# Altium schematic sheet Alimentacion y perifericos.SchDoc
size A4; SheetNumber: 3; SheetTotal: 5
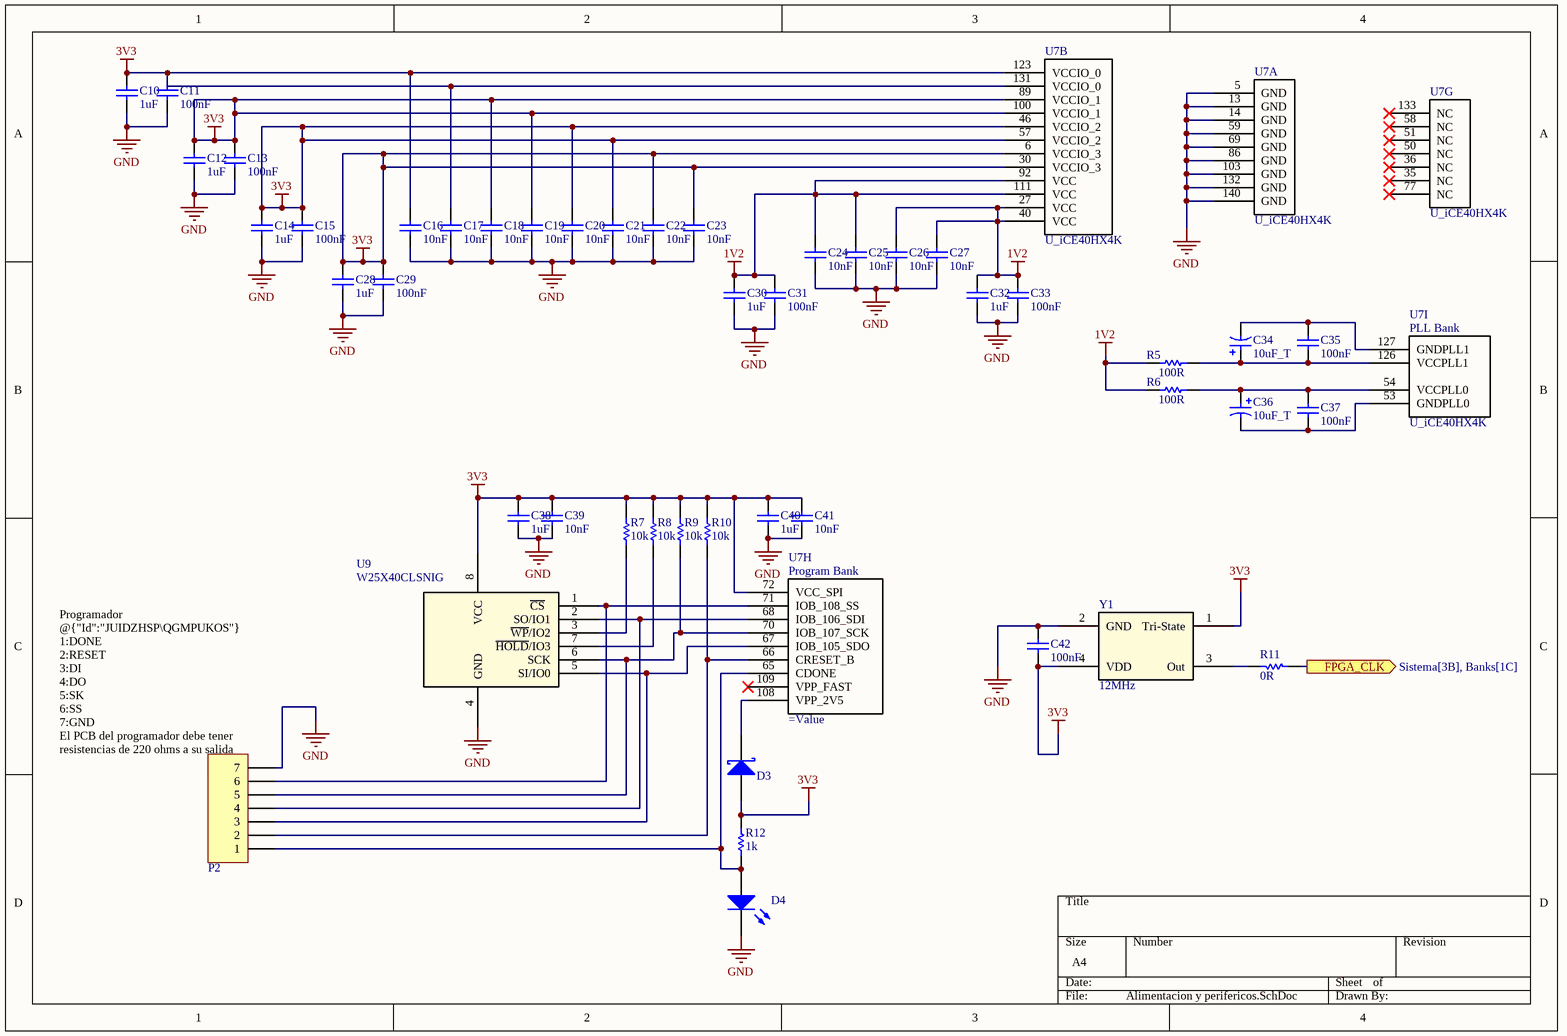
[diagram p0: Alimentacion y perifericos.SchDoc]

## Parts
C10  1uF  [C_0805_2013_b]
C11  100nF  [C_0805_2013_b]
C12  1uF  [C_0805_2013_b]
C13  100nF  [C_0805_2013_b]
C14  1uF  [C_0805_2013_b]
C15  100nF  [C_0805_2013_b]
C16  10nF  [C_0805_2013_b]
C17  10nF  [C_0805_2013_b]
C18  10nF  [C_0805_2013_b]
C19  10nF  [C_0805_2013_b]
C20  10nF  [C_0805_2013_b]
C21  10nF  [C_0805_2013_b]
C22  10nF  [C_0805_2013_b]
C23  10nF  [C_0805_2013_b]
C24  10nF  [C_0805_2013_b]
C25  10nF  [C_0805_2013_b]
C26  10nF  [C_0805_2013_b]
C27  10nF  [C_0805_2013_b]
C28  1uF  [C_0805_2013_b]
C29  100nF  [C_0805_2013_b]
C30  1uF  [C_0805_2013_b]
C31  100nF  [C_0805_2013_b]
C32  1uF  [C_0805_2013_b]
C33  100nF  [C_0805_2013_b]
C34  10uF_T  [C_0805_2013_c]
C35  100nF  [C_0805_2013_b]
C36  10uF_T  [C_0805_2013_c]
C37  100nF  [C_0805_2013_b]
C38  1uF  [C_0805_2013_b]
C39  10nF  [C_0805_2013_b]
C40  1uF  [C_0805_2013_b]
C41  10nF  [C_0805_2013_b]
C42  100nF  [C_0805_2013_b]
D3  SD0805S020S0R5  [D_SOD-123]  (value not drawn)
D4  GREEN  [D_LED_0805_2013]  (value not drawn)
P2  PROGRAM  [P_CON1X7]  (value not drawn)
R5  100R  [R_0805_2012_a]
R6  100R  [R_0805_2012_a]
R7  10k  [R_0805_2012_a]
R8  10k  [R_0805_2012_a]
R9  10k  [R_0805_2012_a]
R10  10k  [R_0805_2012_a]
R11  0R  [R_0805_2012_a]
R12  1k  [R_0805_2012_a]
U7  U_iCE40HX4K  [U_TQFP-144]  (parts A,B,G,H,I of 9)
U9  W25X40CLSNIG  [U_SOIC-8_2]
Y1  12MHz  [Y_SMD-XTAL-12MHz]

## Ports
FPGA_CLK (out, see Sistema[3B], Banks[1C])

## Nets
1V2: C24.1 C25.1 C26.1 C27.1 C30.2 C31.2 C32.2 C33.2 R5.1 R6.1 U7.27(VCC) U7.40(VCC) U7.92(VCC) U7.111(VCC)
3V3: C10.2 C11.2 C12.2 C13.2 C14.2 C15.2 C16.1 C17.1 C18.1 C19.1 C20.1 C21.1 C22.1 C23.1 C28.2 C29.2 C38.2 C39.2 C40.2 C41.2 C42.1 D3.2(A) R7.2 R8.2 R9.2 R10.2 R12.1 U7.6(VCCIO_3) U7.30(VCCIO_3) U7.46(VCCIO_2) U7.57(VCCIO_2) U7.72(VCC_SPI) U7.89(VCCIO_1) U7.100(VCCIO_1) U7.123(VCCIO_0) U7.131(VCCIO_0) U9.8(VCC) Y1.1(Tri-State) Y1.4(VDD)
GND: C10.1 C11.1 C12.1 C13.1 C14.1 C15.1 C16.2 C17.2 C18.2 C19.2 C20.2 C21.2 C22.2 C23.2 C24.2 C25.2 C26.2 C27.2 C28.1 C29.1 C30.1 C31.1 C32.1 C33.1 C38.1 C39.1 C40.1 C41.1 C42.2 D4.1(K) P2.7 U7.5(GND) U7.13(GND) U7.14(GND) U7.59(GND) U7.69(GND) U7.86(GND) U7.103(GND) U7.132(GND) U7.140(GND) U9.4(GND) Y1.2(GND)
FPGA_CLK: R11.1 ; port FPGA_CLK
NetC34_1: C34.1 C35.1 R5.2 U7.126(VCCPLL1)
NetC34_2: C34.2 C35.2 U7.127(GNDPLL1)
NetC36_1: C36.1 C37.1 R6.2 U7.54(VCCPLL0)
NetC36_2: C36.2 C37.2 U7.53(GNDPLL0)
NetD3_1: D3.1(K) U7.108(VPP_2V5)
NetD4_2: D4.2(A) P2.1 R12.2 U7.65(CDONE)
NetP2_2: P2.2 R10.1 U7.66(CRESET_B)
NetP2_3: P2.3 U7.67(IOB_105_SDO) U9.5(SI/IO0)
NetP2_4: P2.4 U7.68(IOB_106_SDI) U9.2(SO/IO1)
NetP2_5: P2.5 R9.1 U7.70(IOB_107_SCK) U9.6(SCK)
NetP2_6: P2.6 U7.71(IOB_108_SS) U9.1(~{CS})
NetR7_1: R7.1 U9.3(~{WP}/IO2)
NetR8_1: R8.1 U9.7(~{HOLD}/IO3)
NetR11_2: R11.2 Y1.3(Out)

Not connected (* = marked no-connect by the designer): U7 35(NC)* 36(NC)* 50(NC)* 51(NC)* 58(NC)* 77(NC)* 109(VPP_FAST)* 133(NC)*

## Notes on the sheet
- (near P2) Programador @{"Id":"JUIDZHSP\QGMPUKOS"}
  1:DONE
  2:RESET
  3:DI
  4:DO
  5:SK
  6:SS
  7:GND
  El PCB del programador debe tener resistencias de 220 ohms a su salida
- (in symbol U_iCE40HX4K, part H) Program Bank
- (in symbol U_iCE40HX4K, part I) PLL Bank

## Library data of the parts
C10 C12 C14 C28 C30 C32 C38 C40 = C_1uF_50V_b: Capacitor SMD 0805; Manufacturer: Cal-Chip Electronics; Manufacturer Part Number: GMC21X7R105K50NT; Supplier 1: Digikey; Supplier Part Number 1: 4713-GMC21X7R105K50NTCT-ND; RoHS: Yes; Category: Ceramic Capacitors; Stock 1: 1410; Pricing 1: 1=0,16, 10=0,106, 50=0,0632, 100=0,0497, 500=0,03672, 1000=0,0304 (USD); Value: 1uF; JLCPCB Part #: C17287262
C11 C13 C15 C29 C31 C33 C35 C37 C42 = C_100nF_50V_b: Capacitor SMD 0805; Manufacturer: Yageo; Manufacturer Part Number: CC0805KRX7R9BB104; Material: Ceramic; Tolerance: 10%; Dielectric: X7R; Voltage: 50V; Insulation Resistance: 100GR; Mounting Technology: Surface Mount; Case/Package: 0805; Pins: 2; Case Code (Metric): 2012; Case Code (Imperial): 0805; Min Operating Temperature: -55°C; Max Operating Temperature: 125°C; Packaging: Tape and Reel; Voltage Rating: 50V; Package Quantity: 4000; Termination: SMD/SMT; Series: CC; Length: 2mm; Height: 0.85mm; Depth: 1.25mm; Radiation Hardening: No; RoHS Compliant: Yes; Reach SVHC Compliant: No; Halogen Free: 5694HalogenFree; Lead Free: 5697LeadFree; ComponentLink1URL: https://datasheet.ciiva.com/11786/0900766b80d84f1d-11786009.pdf?src-supplier=Rs; ComponentLink1Description: https://datasheet.ciiva.com/11786/0900766b80d84f1d-11786009.pdf?src-supplier=Rs; ComponentLink2URL: https://datasheet.ciiva.com/46393/1734573-46393307.pdf?src-supplier=Element14; ComponentLink2Description: https://datasheet.ciiva.com/46393/1734573-46393307.pdf?src-supplier=Element14; ComponentLink3URL: https://datasheet.ciiva.com/155/mlccorderingcode-155930.pdf?src-supplier=Digikey; ComponentLink3Description: https://datasheet.ciiva.com/155/mlccorderingcode-155930.pdf?src-supplier=Digikey; ComponentLink4URL: https://datasheet.ciiva.com/155/mlccorderingcode-155929.pdf?src-supplier=Digikey; ComponentLink4Description: https://datasheet.ciiva.com/155/mlccorderingcode-155929.pdf?src-supplier=Digikey; ComponentLink5URL: https://datasheet.ciiva.com/155/mlccorderingcode-155931.pdf?src-supplier=Digikey; ComponentLink5Description: https://datasheet.ciiva.com/155/mlccorderingcode-155931.pdf?src-supplier=Digikey; ComponentLink6URL: https://datasheet.ciiva.com/11464/upy-gphc-x7r-6-3v-to-50v-8-11464757.pdf?src-supplier=Avnet; ComponentLink6Description: https://datasheet.ciiva.com/11464/upy-gphc-x7r-6-3v-to-50v-8-11464757.pdf?src-supplier=Avnet; ComponentLink7URL: https://datasheet.ciiva.com/28450/1489800-28450805.pdf?src-supplier=Element14; ComponentLink7Description: https://datasheet.ciiva.com/28450/1489800-28450805.pdf?src-supplier=Element14; ComponentLink8URL: https://datasheet.ciiva.com/29242/445210-da-01-en-kerko-chip-0805-x7r-0-1uf-10proz-50vg-29242074.pdf?src-supplier=Conrad; ComponentLink8Description: https://datasheet.ciiva.com/29242/445210-da-01-en-kerko-chip-0805-x7r-0-1uf-10proz-50vg-29242074.pdf?src-supplier=Conrad; Supplier 1: Digikey; Supplier Part Number 1: 311-1140-1-ND; RoHS: Yes; Category: Ceramic Capacitors; Stock 1: 5306374; Pricing 1: 1=0,1, 10=0,07, 50=0,0418, 100=0,0329, 500=0,02428, 1000=0,0201 (USD); Value: 100nF
C16-C27 C39 C41 = C_10nF_50V_b: Capacitor SMD 0805; Manufacturer: KEMET; Manufacturer Part Number: C0805C103J5RAC7210; Dielectric Material: Ceramic; Tolerance: 5%; Voltage Rating: 50V; Dielectric: X7R; Case/Package: 0805; Case Code (Imperial): 0805; Case Code (Metric): 2012; Min Operating Temperature: -55°C; Max Operating Temperature: 125°C; Packaging: Tape and Reel; Package Quantity: 10000; Voltage Rating (DC): 50V; Termination: SMD/SMT; Series: SMD Comm X7R; Length: 2mm; Lead Pitch: 0.75mm; Depth: 1.25mm; RoHS Compliant: Yes; ComponentLink1URL: http://www.mouser.com/ds/2/212/KEM_C1002_X7R_SMD-1102033.pdf?src-supplier=Mouser; ComponentLink1Description: http://www.mouser.com/ds/2/212/KEM_C1002_X7R_SMD-1102033.pdf?src-supplier=Mouser; ComponentLink2URL: http://components.arrow.com/part/dataview/3450688S9650973N7429?src-supplier=Arrow+Electronics; ComponentLink2Description: http://components.arrow.com/part/dataview/3450688S9650973N7429?src-supplier=Arrow+Electronics; ComponentLink3URL: https://datasheet.octopart.com/C0805C103J5RAC7210-KEMET-datasheet-68331906.pdf?src-supplier=Farnell; ComponentLink3Description: https://datasheet.octopart.com/C0805C103J5RAC7210-KEMET-datasheet-68331906.pdf?src-supplier=Farnell; ComponentLink4URL: https://api.kemet.com/component-edge/download/datasheet/C0805C103J5RAC7210.pdf?src-supplier=Digikey; ComponentLink4Description: https://api.kemet.com/component-edge/download/datasheet/C0805C103J5RAC7210.pdf?src-supplier=Digikey; ComponentLink5URL: https://datasheet.octopart.com/C0805C103J5RAC7210-KEMET-datasheet-37550250.pdf?src-supplier=Electro+Sonic; ComponentLink5Description: https://datasheet.octopart.com/C0805C103J5RAC7210-KEMET-datasheet-37550250.pdf?src-supplier=Electro+Sonic; ComponentLink6URL: https://datasheet.octopart.com/C0805C103J5RAC7210-KEMET-datasheet-166547538.pdf?src-supplier=TME; ComponentLink6Description: https://datasheet.octopart.com/C0805C103J5RAC7210-KEMET-datasheet-166547538.pdf?src-supplier=TME; Supplier 1: Mouser; Supplier Part Number 1: 80-C0805C103J5R7210; RoHS: Yes; Category: Ceramic Capacitors; Stock 1: 30128; Pricing 1: 1=0,1, 10=0,034, 50=0,034, 100=0,02, 1000=0,014, 10000=0,009 (USD); Value: 10nF
C34 C36 = C_10uF_10V_b: Capacitor SMD 0805 Tant; Manufacturer: Vishay; Manufacturer Part Number: TMCP1A106MTRF; RoHS Compliant: Yes; Supplier 1: Mouser; Supplier Part Number 1: 74-TMCP1A106MTRF; RoHS: Yes; Category: Tantalum Capacitors; Stock 1: 7293; Pricing 1: 1=0,3, 10=0,152, 50=0,152, 100=0,098, 1000=0,082, 10000=0,067 (USD); Value: 10uF_T
D3 = D_SD0805S020S0R5: Diode SMD D_SD0805S020S0R5; Manufacturer: Diodes; Manufacturer Part Number: B550C-13-F; Max Reverse Current: 500uA; Forward Current: 5A; Max Repetitive Reverse Voltage (Vrrm): 50V; Peak Non-Repetitive Surge Current: 100A; Polarity: Standard; Forward Voltage: 700mV; Mounting Technology: Surface Mount; Case/Package: SMC; Pins: 2; Weight: 0.007408oz; Contact Plating: Tin,Matte; Min Operating Temperature: -55°C; Max Operating Temperature: 125°C; Package Quantity: 3000; Packaging: Tape and Reel; Current Rating: 5A; Output Current: 5A; Series: -; Average Rectified Current: 5A; Max Forward Surge Current (Ifsm): 100A; Termination: SMD/SMT; Voltage Rating (DC): 50V; Max Reverse Voltage (DC): 50V; Length: 7.11mm; Width: 6.22mm; Height: 2.5mm; Radiation Hardening: No; Lead Free: Lead Free; RoHS Compliant: Yes; Reach SVHC Compliant: No; RoHS: Yes; Category: Rectifier Diodes; Stock 1: 65197; Pricing 1: 1=0,56, 10=0,476, 100=0,3309, 500=0,25834, 1000=0,20998 (USD); Value: SD0805S020S0R5; Supplier 1: Digikey; Supplier Part Number 1: 478-7799-1-ND
D4 = D_LED_SMD_0805: (Modificar) Diode SMD 0805; Value: GREEN
P2 = P_BORNERA 7: Bornera 7; Value: BORNERA 6 ENCH
R5 R6 = R_100R_b: Resistor SMD 0805; Manufacturer: Vishay Dale; Manufacturer Part Number: CRCW0805100RFKEA; Tolerance: 1%; Power Rating: 125mW; Voltage Rating: 150V; Temperature Coefficient: 100ppm/°C; Case/Package: 0805; Pins: 2NUMBER; Weight: 0.000194oz; Case Code (Metric): 2012; Case Code (Imperial): 0805; Contact Plating: Tin; Min Operating Temperature: -55°C; Max Operating Temperature: 155°C; Package Quantity: 10; Packaging: Tape and Reel; Resistor Type: Thick Film; Number of Terminations: 2; Termination: SMD/SMT; Max Power Dissipation: 125mW; Features: Automotive AEC-Q200; Series: CRCW; Technology: THICK FILM; Construction: Rectangular; Resistance Tolerance: 1%; Voltage Rating (DC): 150V; Length: 2mm; Width: 0.049inch; Height: 0.45mm; Depth: 1.25mm; Radiation Hardening: No; RoHS Compliant: Yes; Lead Free: 5697LeadFree; Military Standard: Not; Reach SVHC Compliant: Unknown; ComponentLink1URL: https://datasheet.ciiva.com/2495/dcrcwe3-2495842.pdf?src-supplier=Digikey; ComponentLink1Description: https://datasheet.ciiva.com/2495/dcrcwe3-2495842.pdf?src-supplier=Digikey; ComponentLink2URL: https://datasheet.ciiva.com/16760/70201119-16760940.pdf?src-supplier=Allied+Electronics; ComponentLink2Description: https://datasheet.ciiva.com/16760/70201119-16760940.pdf?src-supplier=Allied+Electronics; ComponentLink3URL: https://datasheet.ciiva.com/16777/70201119-16777129.pdf?src-supplier=Allied+Electronics; ComponentLink3Description: https://datasheet.ciiva.com/16777/70201119-16777129.pdf?src-supplier=Allied+Electronics; ComponentLink4URL: https://datasheet.ciiva.com/5546/dcrcwe3-109170-5546700.pdf?src-supplier=Mouser; ComponentLink4Description: https://datasheet.ciiva.com/5546/dcrcwe3-109170-5546700.pdf?src-supplier=Mouser; Supplier 1: Mouser; Supplier Part Number 1: 71-CRCW0805-100-E3; RoHS: Yes; Category: Chip SMD Resistors; Stock 1: 173839; Pricing 1: 1=0,1, 10=0,025, 50=0,025, 100=0,015, 1000=0,012, 10000=0,008 (USD); Value: 100R
R7-R10 = R_10k_b: Resistor SMD 0805; Manufacturer: Yageo; Manufacturer Part Number: AC0805FR-0710KL; Tolerance: 1%; Power Rating: 125mW; Voltage Rating: 150V; Temperature Coefficient: 100ppm/°C; Case/Package: 0805; Case Code (Metric): 2012; Case Code (Imperial): 0805; Min Operating Temperature: -55°C; Max Operating Temperature: 155°C; Packaging: Tape and Reel; Package Quantity: 1; Number of Terminations: 2; Termination: SMD/SMT; Max Power Dissipation: 125mW; Features: Moisture Resistant,Automotive AEC-Q200,Anti-Sulfur; Series: AC; Construction: Rectangular; Length: 0.079inch; Width: 0.049inch; Height: 0.024inch; Depth: 1.25mm; Military Standard: Not; Lead Free: Lead Free; RoHS Compliant: Yes; ComponentLink1URL: http://www.yageo.com/NewPortal/yageodocoutput?fileName=/pdf/R-Chip/PYu-AC_51_RoHS_L_6.pdf&src-supplier=Digikey; ComponentLink1Description: http://www.yageo.com/NewPortal/yageodocoutput?fileName=/pdf/R-Chip/PYu-AC_51_RoHS_L_6.pdf&src-supplier=Digikey; ComponentLink2URL: http://www.yageo.com/documents/recent/PYu-AC_51_RoHS_L_2_revised.pdf?src-supplier=Future+Electronics; ComponentLink2Description: http://www.yageo.com/documents/recent/PYu-AC_51_RoHS_L_2_revised.pdf?src-supplier=Future+Electronics; ComponentLink3URL: http://www.yageo.com/NewPortal/yageodocoutput?fileName=/pdf/R-Chip/PYu-AC_51_RoHS_L_6.pdf&src-supplier=NAC+Semi; ComponentLink3Description: http://www.yageo.com/NewPortal/yageodocoutput?fileName=/pdf/R-Chip/PYu-AC_51_RoHS_L_6.pdf&src-supplier=NAC+Semi; ComponentLink4URL: http://www.yageo.com/NewPortal/yageodocoutput?fileName=/pdf/R-Chip/PYu-AC_51_RoHS_L_6.pdf&src-supplier=Rutronik; ComponentLink4Description: http://www.yageo.com/NewPortal/yageodocoutput?fileName=/pdf/R-Chip/PYu-AC_51_RoHS_L_6.pdf&src-supplier=Rutronik; Supplier 1: Digikey; Supplier Part Number 1: 311-10KLGCT-ND; RoHS: Yes; Category: Chip SMD Resistors; Stock 1: 480247; Pricing 1: 1=0,1, 10=0,031, 50=0,0198, 100=0,0166, 500=0,01152, 1000=0,00997 (USD); Value: 10k
R11 = R_0R_b: Resistor SMD 0805; Manufacturer: Stackpole Electronics; Manufacturer Part Number: RMCF0805ZT0R00; Power Rating: 125mW; Temperature Coefficient: 200ppm/°C; Voltage Rating: 150V; Mounting Technology: Surface Mount; Case/Package: 0805; Case Code (Metric): 2012; Case Code (Imperial): 0805; Contact Plating: Tin,Matte; Min Operating Temperature: -55°C; Max Operating Temperature: 155°C; Packaging: Tape and Reel; Number of Terminations: 2; Max Power Dissipation: 125mW; Features: Automotive AEC-Q200; Series: RMCF; Construction: Rectangular; Length: 2mm; Width: 0.049inch; Height: 0.026inch; Depth: 1.25mm; Ratings: AEC-Q200; Radiation Hardening: No; Lead Free: Lead Free; Military Standard: Not; RoHS Compliant: Yes; ComponentLink1URL: https://datasheet.ciiva.com/15193/getdatasheetpartid-360417-15193658.pdf?src-supplier=Verical; ComponentLink1Description: https://datasheet.ciiva.com/15193/getdatasheetpartid-360417-15193658.pdf?src-supplier=Verical; Supplier 1: Digikey; Supplier Part Number 1: RMCF0805ZT0R00CT-ND; RoHS: Yes; Category: Chip SMD Resistors; Stock 1: 1321891; Pricing 1: 1=0,1, 10=0,017, 25=0,0128, 50=0,0096, 100=0,0068, 250=0,00544, 500=0,00436, 1000=0,00321 (USD); Value: 0R
R12 = R_1k_b: Resistor SMD 0805; Manufacturer: Bourns; Manufacturer Part Number: CR0805-FX-1001ELF; Tolerance: 1%; Temperature Coefficient: 100ppm/°C; Power Rating: 125mW; Voltage Rating: 150V; Mounting Technology: Surface Mount; Case/Package: 0805; Pins: 2; Contact Plating: Tin; Case Code (Imperial): 0805; Case Code (Metric): 2012; Min Operating Temperature: -55°C; Max Operating Temperature: 155°C; Resistor Type: Thick Film; Packaging: Tape and Reel; Package Quantity: 5000; Termination: SMD/SMT; Number of Terminations: 2; Max Power Dissipation: 125mW; Voltage Rating (DC): 150V; Features: Moisture Resistant; Series: CR0805; Resistance Tolerance: 1%; Technology: THICK FILM; Length: 2mm; Width: 1.25mm; Height: 0.5mm; Depth: 1.25mm; Thickness: 508um; Radiation Hardening: No; Reach SVHC Compliant: No; RoHS Compliant: Yes; ComponentLink1URL: https://datasheet.ciiva.com/11810/0900766b80fcdb72-11810305.pdf?src-supplier=Rs; ComponentLink1Description: https://datasheet.ciiva.com/11810/0900766b80fcdb72-11810305.pdf?src-supplier=Rs; ComponentLink2URL: https://datasheet.ciiva.com/27049/775383-27049976.pdf?src-supplier=Jameco; ComponentLink2Description: https://datasheet.ciiva.com/27049/775383-27049976.pdf?src-supplier=Jameco; ComponentLink3URL: https://datasheet.ciiva.com/7986/1856384-7986222.pdf?src-supplier=Element14; ComponentLink3Description: https://datasheet.ciiva.com/7986/1856384-7986222.pdf?src-supplier=Element14; ComponentLink4URL: https://datasheet.ciiva.com/9123/chpreztr-9123643.pdf?src-supplier=Avnet; ComponentLink4Description: https://datasheet.ciiva.com/9123/chpreztr-9123643.pdf?src-supplier=Avnet; ComponentLink5URL: https://datasheet.ciiva.com/6547/chpreztr-6547422.pdf?src-supplier=Digikey; ComponentLink5Description: https://datasheet.ciiva.com/6547/chpreztr-6547422.pdf?src-supplier=Digikey; ComponentLink6URL: https://datasheet.ciiva.com/6547/chpreztr-6547423.pdf?src-supplier=Digikey; ComponentLink6Description: https://datasheet.ciiva.com/6547/chpreztr-6547423.pdf?src-supplier=Digikey; ComponentLink7URL: https://datasheet.ciiva.com/6547/chpreztr-6547421.pdf?src-supplier=Digikey; ComponentLink7Description: https://datasheet.ciiva.com/6547/chpreztr-6547421.pdf?src-supplier=Digikey; ComponentLink8URL: https://datasheet.ciiva.com/30129/159chpreztr-30129981.pdf?src-supplier=Onlinecomponents.com; ComponentLink8Description: https://datasheet.ciiva.com/30129/159chpreztr-30129981.pdf?src-supplier=Onlinecomponents.com; ComponentLink9URL: https://datasheet.ciiva.com/46394/691949-46394380.pdf?src-supplier=Element14; ComponentLink9Description: https://datasheet.ciiva.com/46394/691949-46394380.pdf?src-supplier=Element14; ComponentLink10URL: https://datasheet.ciiva.com/16722/70154685-16722677.pdf?src-supplier=Allied+Electronics; ComponentLink10Description: https://datasheet.ciiva.com/16722/70154685-16722677.pdf?src-supplier=Allied+Electronics; ComponentLink11URL: https://datasheet.ciiva.com/48692/001055506-da-01-en-smd-wid-cr0805-fx-1001elf-1k-ohm-1-8w-48692106.pdf?src-supplier=Conrad; ComponentLink11Description: https://datasheet.ciiva.com/48692/001055506-da-01-en-smd-wid-cr0805-fx-1001elf-1k-ohm-1-8w-48692106.pdf?src-supplier=Conrad; Supplier 1: Digikey; Supplier Part Number 1: CR0805-FX-1001ELFCT-ND; RoHS: Yes; Category: Chip SMD Resistors; Stock 1: 453972; Pricing 1: 1=0,1, 10=0,021, 50=0,0132, 100=0,011, 500=0,00744, 1000=0,00639 (USD); Value: 1k
U9 = U_W25X40CLSNIG: Supplier 1: Digikey; Supplier Part Number 1: W25X40CLSNIG-ND
Y1 = Y_12MHZ: Supplier 1: Digikey; Supplier Part Number 1: XC2882CT-ND
U7 = U_iCE40HX4K: Supplier 1: Digikey; Supplier Part Number 1: 220-1572-ND